# Altium project UZ_A_LTC2311.PrjPCB (part 1 of 2)
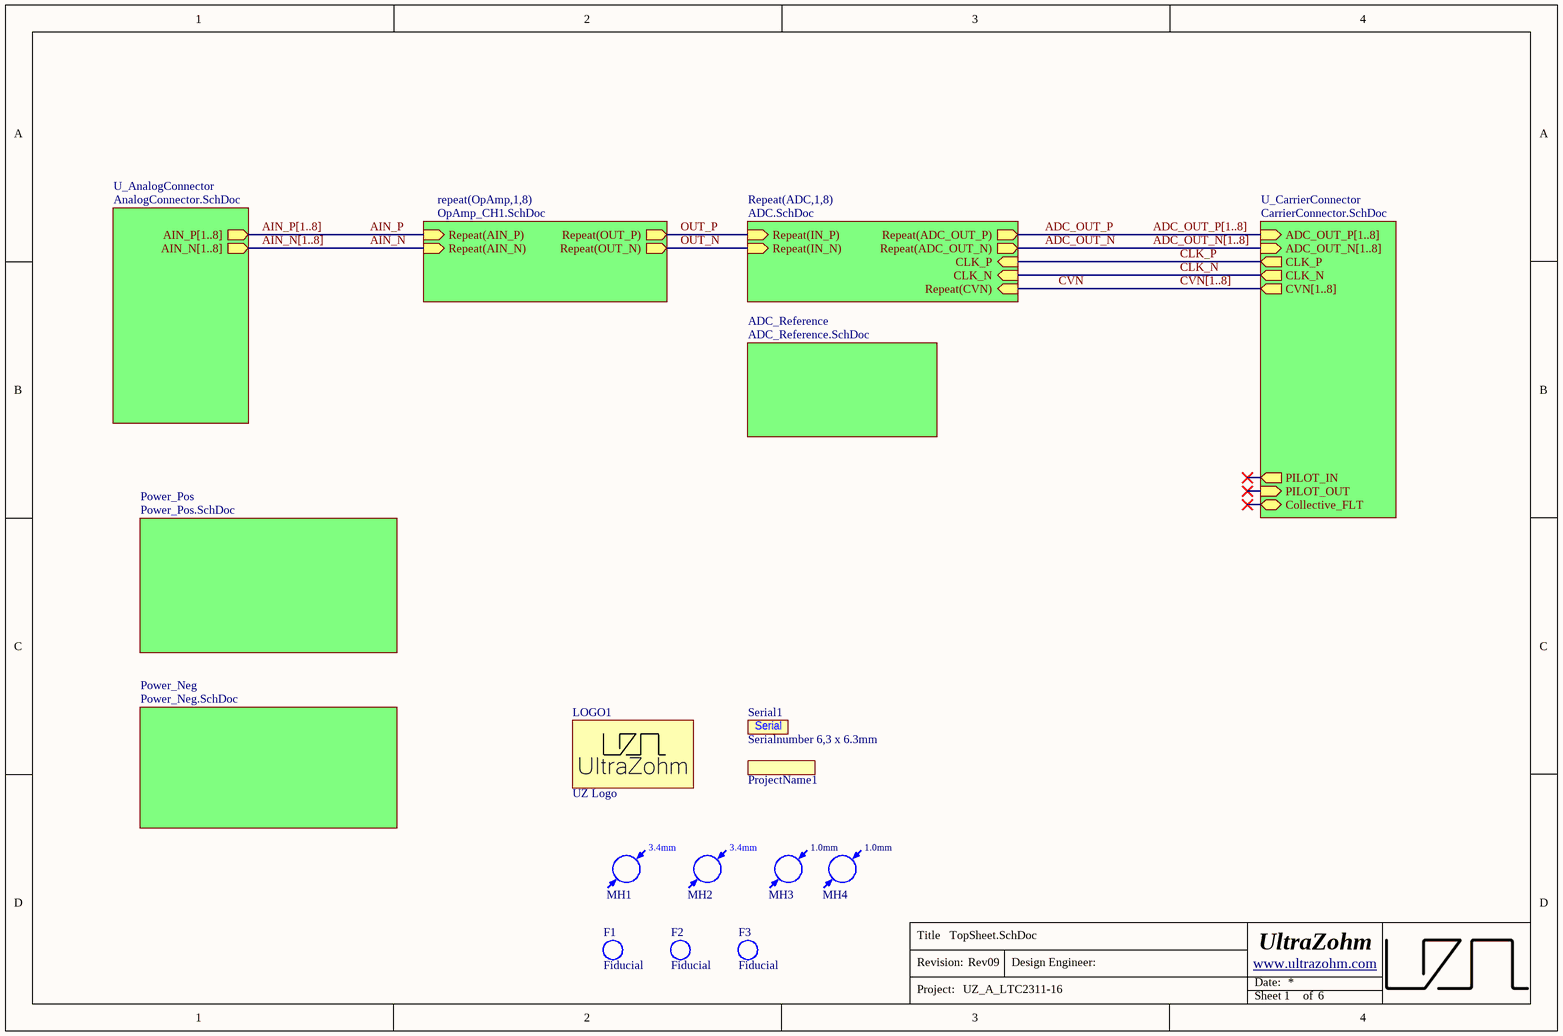
[diagram p0: TopSheet.SchDoc]
ProjectRevision: Rev09; ProjectName: UZ_A_LTC2311-16; ProjectAuthor: =Author; Date: 12/24; AuthorParam: =Author; Author: E. Aufderheide & A. Geiger
8 sheets, 519 parts. Net scope: hierarchical (ports join the sheet entries above them; power ports are global).
Board file: UltraZohm_ADC.PcbDoc
Sheets:
  TopSheet.SchDoc
    Power_Pos = Power_Pos.SchDoc
    U_CarrierConnector = CarrierConnector.SchDoc
    U_AnalogConnector = AnalogConnector.SchDoc
    ADC1 = ADC.SchDoc
    ADC2 = ADC.SchDoc
    ADC3 = ADC.SchDoc
    ADC4 = ADC.SchDoc
    ADC5 = ADC.SchDoc
    ADC6 = ADC.SchDoc
    ADC7 = ADC.SchDoc
    ADC8 = ADC.SchDoc
    OpAmp1 = OpAmp_CH1.SchDoc
    OpAmp2 = OpAmp_CH1.SchDoc
    OpAmp3 = OpAmp_CH1.SchDoc
    OpAmp4 = OpAmp_CH1.SchDoc
    OpAmp5 = OpAmp_CH1.SchDoc
    OpAmp6 = OpAmp_CH1.SchDoc
    OpAmp7 = OpAmp_CH1.SchDoc
    OpAmp8 = OpAmp_CH1.SchDoc
    Power_Neg = Power_Neg.SchDoc
    ADC_Reference = ADC_Reference.SchDoc

## Sheet TopSheet.SchDoc
size A4; CompanyName: Technische Hochschule Nürnberg Georg Simon Ohm; Organization: UltraZohm; Address1: Kesslerplatz 12; Address2: 90489 Nürnberg; Address3: GERMANY; DocumentNumber: 1; SheetNumber: 1; SheetTotal: 6; Website: www.ultrazohm.com

### Parts
F1  Fiducial  [Fiducial_1.7mm]  (no BOM)
F2  Fiducial  [Fiducial_1.7mm]  (no BOM)
F3  Fiducial  [Fiducial_1.7mm]  (no BOM)
LOGO1  UZ Logo  [UZ_Logo_tiny]  (no BOM)
MH1  mounting hole 3,4mm  [MH_3.4]  (value not drawn)  (no BOM)
MH2  mounting hole 3,4mm  [MH_3.4]  (value not drawn)  (no BOM)
MH3  alignment hole 1mm  [MH_1]  (value not drawn)
MH4  alignment hole 1mm  [MH_1]  (value not drawn)
ProjectName1  Project Name, Rev  [ID_ProjectRev]  (value not drawn)  (no BOM)
Serial1  Serialnumber 6,3 x 6.3mm  [Serial_6.3x6.3mm]  (no BOM)

### Sub-sheets
ADC_Reference = ADC_Reference.SchDoc: no entries
Power_Neg = Power_Neg.SchDoc: no entries
Power_Pos = Power_Pos.SchDoc: no entries
Repeat(ADC,1,8) = ADC.SchDoc: Repeat(CVN) (in), Repeat(ADC_OUT_N) (out), Repeat(ADC_OUT_P) (out), Repeat(IN_N) (in), CLK_P (in), CLK_N (in), Repeat(IN_P) (in)
repeat(OpAmp,1,8) = OpAmp_CH1.SchDoc: Repeat(AIN_P) (in), Repeat(AIN_N) (in), Repeat(OUT_P) (out), Repeat(OUT_N) (out)
U_AnalogConnector = AnalogConnector.SchDoc: AIN_P[1..8] (out), AIN_N[1..8] (out)
U_CarrierConnector = CarrierConnector.SchDoc: PILOT_OUT (in), PILOT_IN (out), Collective_FLT (bidir), CLK_P (out), CLK_N (out), ADC_OUT_P[1..8] (in), ADC_OUT_N[1..8] (in), CVN[1..8] (out)

### Nets
ADC_OUT_N: sheet Repeat(ADC,1,8)/Repeat(ADC_OUT_N)
ADC_OUT_P: sheet Repeat(ADC,1,8)/Repeat(ADC_OUT_P)
AIN_N: sheet repeat(OpAmp,1,8)/Repeat(AIN_N)
AIN_P: sheet repeat(OpAmp,1,8)/Repeat(AIN_P)
CLK_N: sheet U_CarrierConnector/CLK_N, sheet Repeat(ADC,1,8)/CLK_N
CLK_P: sheet U_CarrierConnector/CLK_P, sheet Repeat(ADC,1,8)/CLK_P
CVN: sheet Repeat(ADC,1,8)/Repeat(CVN)
OUT_N: sheet Repeat(ADC,1,8)/Repeat(IN_N), sheet repeat(OpAmp,1,8)/Repeat(OUT_N)
OUT_P: sheet Repeat(ADC,1,8)/Repeat(IN_P), sheet repeat(OpAmp,1,8)/Repeat(OUT_P)

### Buses and harness runs
bus ADC_OUT_N[1..8] = sheet U_CarrierConnector/ADC_OUT_N[1..8]
bus ADC_OUT_P[1..8] = sheet U_CarrierConnector/ADC_OUT_P[1..8]
bus AIN_N[1..8] = sheet U_AnalogConnector/AIN_N[1..8]
bus AIN_P[1..8] = sheet U_AnalogConnector/AIN_P[1..8]
bus CVN[1..8] = sheet U_CarrierConnector/CVN[1..8]

### Notes on the sheet
- Title
- Revision:
- Design Engineer:
- Date:
- Project:
- Sheet
- of
- (in symbol Mounting Hole) 3.4mm
- (in symbol Mounting Hole - 1mm) 1.0mm
- (in symbol SerialNumber) Serial

### Library data of the parts
F1-F3 = Fiducial: Fiducial for Assembler
LOGO1 = UZ Logo: UltraZohm Logo on PCB; Created: Jan2021_Liegmann; Value: UZ Logo
MH1 MH2 = Mounting Hole: Non plated through hole, 3.4mm
MH3 MH4 = Mounting Hole - 1mm: Non plated through hole, 1mm
ProjectName1 = ID_ProjectRev: Project Name and Revision Number; Created: 2018_11_23_AGeiger; Value: Project Name, Rev
Serial1 = SerialNumber: Created: 2018_09_18_AGeiger; Value: Serialnumber 6,3 x 6.3mm

## Sheet Power_Pos.SchDoc
size A4; CompanyName: Technische Hochschule Nürnberg Georg Simon Ohm; Organization: UltraZohm; Address1: Kesslerplatz 12; Address2: 90489 Nürnberg; Address3: GERMANY; DocumentNumber: 2; SheetNumber: 2; SheetTotal: 6; Website: www.ultrazohm.com
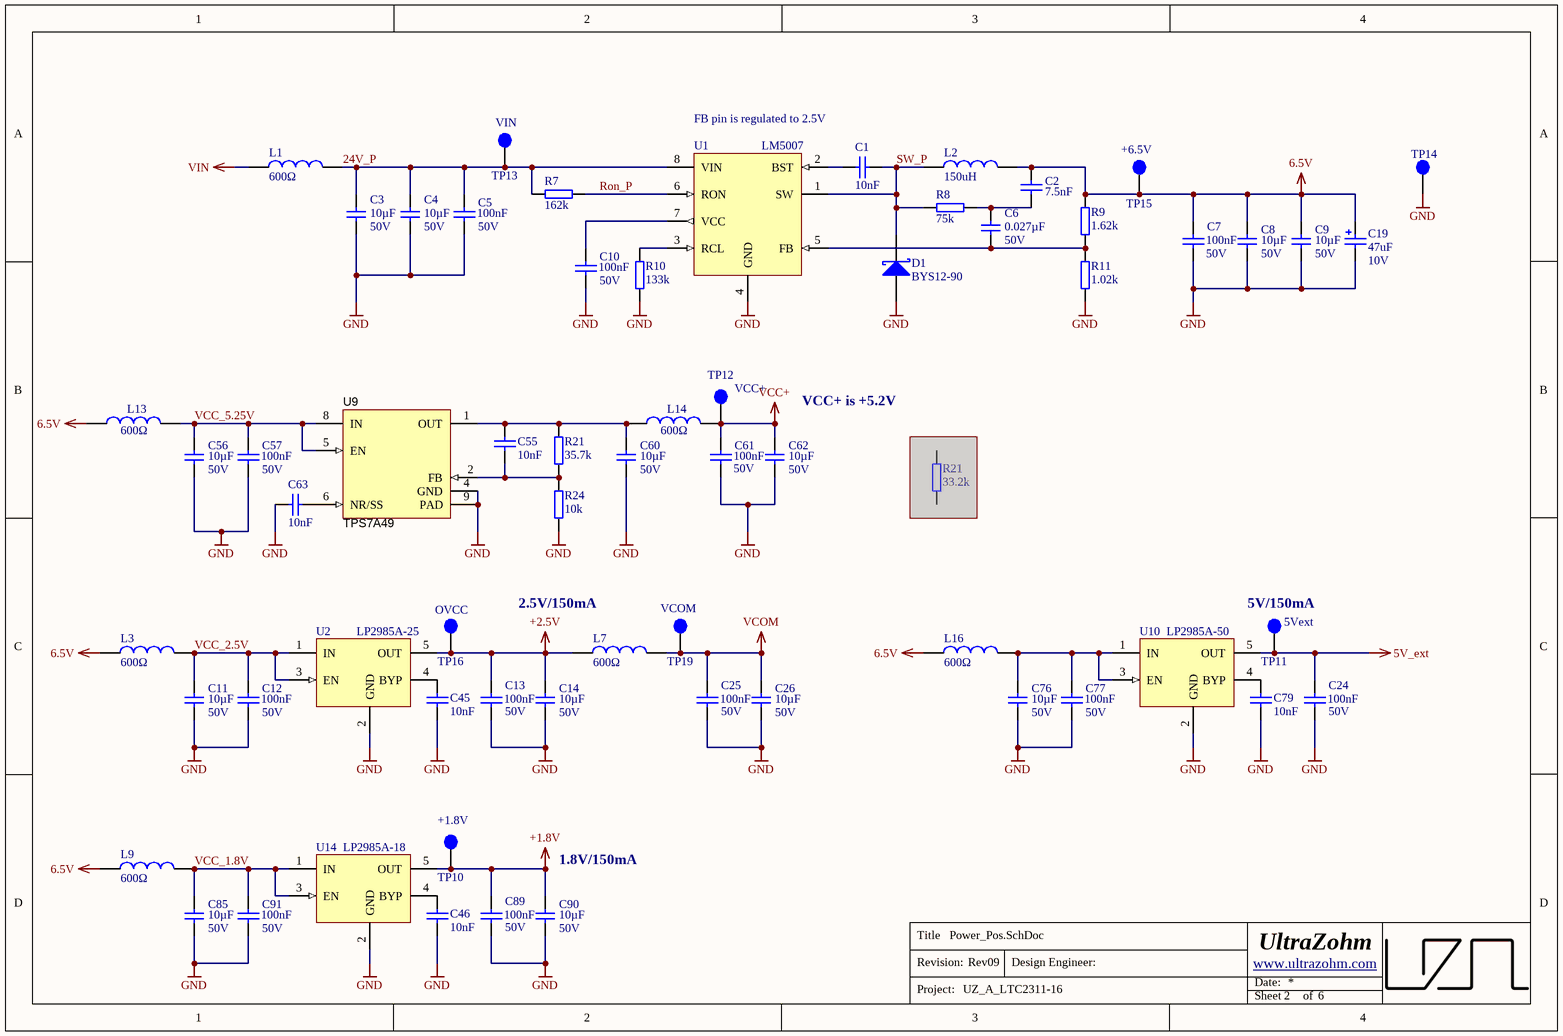
[diagram p1: Power_Pos.SchDoc]

### Parts
(Parts that share a designator on the sheet are numbered #1, #2 ... from top to bottom, then left to right.)
C1  10nF  [CAPC1608X07N]
C2  7.5nF  [CAPC1608X07N]
C3  10µF  Voltage: 50V  [C_1206]
C4  10µF  Voltage: 50V  [C_1206]
C5  100nF  Voltage: 50V  [CAPC1608X07N]
C6  0.027µF  Voltage: 50V  [C_1206]
C7  100nF  Voltage: 50V  [CAPC1608X07N]
C8  10µF  Voltage: 50V  [C_1206]
C9  10µF  Voltage: 50V  [C_1206]
C10  100nF  Voltage: 50V  [CAPC1608X07N]
C11  10µF  Voltage: 50V  [C_1206]
C12  100nF  Voltage: 50V  [CAPC1608X07N]
C13  100nF  Voltage: 50V  [CAPC1608X07N]
C14  10µF  Voltage: 50V  [C_1206]
C19  47uF  Voltage: 10V  [WCAP-ASLI_5x5.5]
C24  100nF  Voltage: 50V  [CAPC1608X07N]
C25  100nF  Voltage: 50V  [CAPC1608X07N]
C26  10µF  Voltage: 50V  [C_1206]
C45  10nF  [CAPC1608X07N]
C46  10nF  [CAPC1608X07N]
C55  10nF  [CAPC1608X07N]
C56  10µF  Voltage: 50V  [C_1206]
C57  100nF  Voltage: 50V  [CAPC1608X07N]
C60  10µF  Voltage: 50V  [C_1206]
C61  100nF  Voltage: 50V  [CAPC1608X07N]
C62  10µF  Voltage: 50V  [C_1206]
C63  10nF  [CAPC1608X07N]
C76  10µF  Voltage: 50V  [C_1206]
C77  100nF  Voltage: 50V  [CAPC1608X07N]
C79  10nF  [CAPC1608X07N]
C85  10µF  Voltage: 50V  [C_1206]
C89  100nF  Voltage: 50V  [CAPC1608X07N]
C90  10µF  Voltage: 50V  [C_1206]
C91  100nF  Voltage: 50V  [CAPC1608X07N]
D1  BYS12-90  [DIOM4227X23N]
L1  600Ω  [WE-CBF_0805_High Current]
L2  150uH  [SMT_inductor_1050_Performance]
L3  600Ω  [WE-CBF_0805_High Current]
L7  600Ω  [WE-CBF_0805_High Current]
L9  600Ω  [WE-CBF_0805_High Current]
L13  600Ω  [WE-CBF_0805_High Current]
L14  600Ω  [WE-CBF_0805_High Current]
L16  600Ω  [WE-CBF_0805_High Current]
R7  162k  [RESC1608X06N]
R8  75k  [RESC1608X06N]
R9  1.62k  [RESC1608X06N]
R10  133k  [RESC1608X06N]
R11  1.02k  [RESC1608X06N]
R21#1  35.7k  [RESC1608X06N]
R21#2  33.2k  [RESC1608X06N]  (masked out: inside a compile mask, not in the netlist)
R24  10k  [RESC1608X06N]
TP10  +1.8V  [TP_1mm]  (no BOM)
TP11  5Vext  [TP_1mm]  (no BOM)
TP12  VCC+  [TP_1mm]  (no BOM)
TP13  VIN  [TP_1mm]  (no BOM)
TP14  GND  [TP_1mm]  (value not drawn)  (no BOM)
TP15  +6.5V  [TP_1mm]  (no BOM)
TP16  OVCC  [TP_1mm]  (no BOM)
TP19  VCOM  [TP_1mm]  (no BOM)
U1  LM5007  [TSOP65P490X110-8N]
U2  LP2985A-25  [SOT95P250X110-5N]
U9  TPS7A49  [DGN0008D_N]
U10  LP2985A-50  [SOT95P250X110-5N]
U14  LP2985A-18  [SOT95P250X110-5N]

### Nets
5V_ext: C24.1 TP11.1 U10.5(OUT)
6.5V: C2.1 C7.2 C8.2 C9.2 C19.2(P) L2.2 L3.1 L9.1 L13.1 L16.1 R9.2 TP15.1
+1.8V: C89.1 C90.2 TP10.1 U14.5(OUT)
+2.5V: C13.1 C14.2 L7.1 TP16.1 U2.5(OUT)
GND: C3.1 C4.1 C5.2 C7.1 C8.1 C9.1 C10.2 C11.1 C12.2 C13.2 C14.1 C19.1(N) C24.2 C25.2 C26.1 C45.1 C46.1 C56.1 C57.2 C60.1 C61.1 C62.1 C63.2 C76.1 C77.2 C79.1 C85.1 C89.2 C90.1 C91.2 D1.2(A) R10.1 R11.1 R24.2 TP14.1 U1.4(GND) U2.2(GND) U9.4(GND) U9.9(PAD) U10.2(GND) U14.2(GND)
VCC+: C61.2 C62.2 L14.2 TP12.1
VCOM: C25.1 C26.2 L7.2 TP19.1
VIN: L1.1
24V_P: C3.2 C4.2 C5.1 L1.2 R7.1 TP13.1 U1.8(VIN)
Ron_P: R7.2 U1.6(RON)
SW_P: C1.2 D1.1(K) L2.1 R8.1 U1.1(SW)
VCC_1.8V: C85.2 C91.1 L9.2 U14.1(IN) U14.3(EN)
VCC_2.5V: C11.2 C12.1 L3.2 U2.1(IN) U2.3(EN)
VCC_5.25V: C56.2 C57.1 L13.2 U9.5(EN) U9.8(IN)
NetC1_1: C1.1 U1.2(BST)
NetC2_2: C2.2 C6.2 R8.2
NetC6_1: C6.1 R9.1 R11.2 U1.5(FB)
NetC10_1: C10.1 U1.7(VCC)
NetC45_2: C45.2 U2.4(BYP)
NetC46_2: C46.2 U14.4(BYP)
NetC55_1: C55.1 C60.2 L14.1 R21#1.1 U9.1(OUT)
NetC55_2: C55.2 R21#1.2 R24.1 U9.2(FB)
NetC63_1: C63.1 U9.6(NR/SS)
NetC76_2: C76.2 C77.1 L16.2 U10.1(IN) U10.3(EN)
NetC79_2: C79.2 U10.4(BYP)
NetR10_2: R10.2 U1.3(RCL)

Not connected (* = marked no-connect by the designer): U9 3(NC) 7(DNC)

### Notes on the sheet
- FB pin is regulated to 2.5V
- VCC+ is +5.2V
- (near L7) 2.5V/150mA
- (near TP11) 5V/150mA
- (near C90) 1.8V/150mA
- Title
- Revision:
- Design Engineer:
- Date:
- Project:
- Sheet
- of

### Library data of the parts
C1 C45 C46 C79 = Cap_0603: MPN: 885012206065; MF: Würth; Voltage: 25V; Dielectric: X7R; Value: 10nF; Supplier 1: Mouser; Supplier 2: *; Supplier Part Number 1: 710-885012206065; Supplier Part Number 2: *; Package: 0603
C2 = Cap_0603: MPN: C0603C752J3GACTU; MF: KEMET; Voltage: 25V; Dielectric: C0G; Value: 7.5nF; Supplier 1: Mouser; Supplier 2: *; Supplier Part Number 1: 80-C0603C752J3GACTU; Supplier Part Number 2: *; Package: 0603
C3 C4 = C_1206: Capacitor 1206; MPN: CL31A106MBHNNNE; Tolerance: 20%; MF: Samsung; Dielectric: X5R; Package: 1206; Value: 10µF; Supplier 1: Mouser; Supplier Part Number 1: 187-CL31A106MBHNNNE
C5 C10 C12 C57 C61 C77 C91 = Cap_0603: MPN: CC0603KRX7R9BB104; MF: Yageo; Tolerance: 10%; Dielectric: X5R; Value: 100nF; Supplier 1: Mouser; Supplier 2: Mouser; Supplier Part Number 1: 603-CC603KRX7R9BB104; Supplier Part Number 2: 710-885382206004; Package: 0603
C6 = C_1206: Capacitor 1206; MPN: GRM3195C1H273JA01D; Tolerance: 5%; MF: Murata; Dielectric: C0G; Package: 1206; Value: 0.027µF; Created: 2018_06_25_AGeiger; Supplier 1: Mouser; Supplier Part Number 1: 81-GRM315C1H273JA01D
C7 C13 C24 C25 C89 = Cap_0603: MPN: CC0603KRX7R9BB104; MF: Yageo; Dielectric: X5R; Value: 100nF; Supplier 1: Mouser; Supplier 2: Mouser; Supplier Part Number 1: 603-CC603KRX7R9BB104; Supplier Part Number 2: 710-885382206004; Package: 0603
C8 C9 C11 C14 C26 C56 C60 C62 C76 C85 C90 = C_1206: Capacitor 1206; MPN: CL31A106MBHNNNE; Tolerance: 10%; MF: Samsung; Dielectric: X5R; Package: 1206; Value: 10µF; Created: 2020_09_17_Liegmann; Supplier 1: Mouser; Supplier Part Number 1: 187-CL31A106MBHNNNE
C19 = 865080142007: WCAP-ASLI Aluminum Electrolytic Capacitor, V-Chip, SMT, D5xH5.5mm, 47uF, 10V; MPN: 865080242004; Dissipation Factor: 24%; Endurance: 2000h; Leakage Current: 6.3uA; MF: Wurth Elektronik; Ripple Current: 170mA; Capacitance Tolerance: +/-20%; Technical Reference: ASEC055101M6R3DVCTBB000; ComponentLink1Description: Manufacturer; ComponentLink1URL: http://www.we-online.de; ComponentLink2Description: Datasheet; ComponentLink2URL: https://www.we-online.com/catalog/datasheet/865080142007.pdf; Height: 5.5mm; Mounting Technology: SMT; Operating Temperature: -55 to +105degC; Packaging: Tape and Reel; Published Date: May 2020; Diameter: 5mm; Supplier 1: Mouser; Supplier Part Number 1: 710-865080242004; Value: 47uF
C55 C63 = Cap_0603: MPN: 885012206065; MF: Würth Elektronik; Voltage: 25V; Dielectric: X7R; Value: 10nF; Supplier 1: Mouser; Supplier 2: Digi-Key; Supplier Part Number 1: 710-885012206065; Supplier Part Number 2: 732-7983-1-ND; Package: 0603
D1 = BYS12-90: Schottky Diode; MPN: BYS12-90-E3/TR3; MF: Vishay; Forward Voltage: 750mV; Reverse Voltage: 90V; Rated Current: 1.5A; Package: DO-214AC; Supplier 1: Farnell; Supplier 2: Mouser; Supplier 3: Digi-Key; Supplier Part Number 1: 2889144; Supplier Part Number 2: 625-BYS12-90-E3/TR3; Supplier Part Number 3: BYS12-90-E3/GICT-ND; ComponentLink1Description: Manufacturer; ComponentLink1URL: https://www.vishay.com/; ComponentLink2Description: Datasheet; ComponentLink2URL: https://www.vishay.com/docs/88950/bys12-90.pdf
L1 L3 L7 L9 L16 = WE-CBF, 742792040: WE-CBF SMD EMI Suppression Ferrite Bead, 0805, 600Ω; MF: Wurth Elektronik; Type: High Current; PublishedDate: Aug 2016; ComponentLink1Description: Manufacturer; ComponentLink1URL: http://www.we-online.de; ComponentLink2Description: Datasheet; ComponentLink2URL: http://katalog.we-online.de/pbs/datasheet/742792040.pdf; MPN: 742792040; Value: 600Ω; Size: 0805; Supplier 1: Farnell; Supplier 2: Mouser; Supplier 3: Digi-Key; Supplier Part Number 1: 2761567; Supplier Part Number 2: 710-742792040; Supplier Part Number 3: 732-1620-1-ND
L2 = B82464G4154M: SMT power Inductor, 150uH, 320m DRC; MF: EPCOS / TDK; Rated Current: 0.85 A; MPN: B82464G4154M; Supplier 1: Mouser; Supplier Part Number 1: 871-B82464G4154M; Value: 150uH; DCR: 320m; ComponentLink1Description: Manufacturer; ComponentLink1URL: https://www.tdk-electronics.tdk.com/de; ComponentLink2Description: Datasheet; ComponentLink2URL: https://www.tdk-electronics.tdk.com/inf/30/db/ind_2008/b82464g4.pdf
L13 L14 = WE-CBF, 742792040: WE-CBF SMD EMI Suppression Ferrite Bead, 0805, 600Ω; MF: Würth Elektronik; Type: High Current; ComponentLink1Description: Manufacturer; ComponentLink1URL: http://www.we-online.de; ComponentLink2Description: Datasheet; ComponentLink2URL: http://katalog.we-online.de/pbs/datasheet/742792040.pdf; MPN: 742792040; Value: 600Ω; Size: 0805; Supplier 1: Farnell; Supplier 2: Mouser; Supplier 3: Digi-Key; Supplier Part Number 1: 1635735; Supplier Part Number 2: 710-742792040; Supplier Part Number 3: 732-1620-1-ND
R7 = R_0603: MPN: CR0603-FX-1623ELF; MF: Bourns; Value: 162k; Supplier 1: Mouser; Supplier Part Number 1: 652-CR0603-FX1623ELF; Package: 0603
R8 = R_0603: MPN: AC0603FR-1375KL; MF: Yageo; Value: 75k; Supplier 1: Mouser; Supplier Part Number 1: 603-AC0603FR-1375KL; Package: 0603
R9 = R_0603: MPN: CR0603-FX-1621ELF; MF: Bourns; Tolerance: 1%; Value: 1.62k; Supplier 1: Mouser; Supplier Part Number 1: 652-CR0603FX-1621ELF; Package: 0603
R10 = R_0603: MPN: CR0603-FX-1333ELF; MF: Bourns; Value: 133k; Supplier 1: Mouser; Supplier Part Number 1: 652-CR0603FX-1333ELF; Package: 0603
R11 = R_0603: MPN: CR0603-FX-1021ELF; MF: Bourns; Tolerance: 1%; Value: 1.02k; Supplier 1: Mouser; Supplier Part Number 1: 652-CR0603FX-1021ELF; Package: 0603
R21#1 = R_0603: MPN: CR0603-FX-3572ELF; MF: Bourns; Tolerance: 1%; Value: 35.7k; Supplier 1: Mouser; Supplier Part Number 1: 652-CR0603FX-3572ELF; Package: 0603
R21#2 = R_0603: MPN: CR0603-FX-3322ELF; MF: Bourns; Tolerance: 1%; Value: 33.2k; Supplier 1: Mouser; Supplier Part Number 1: 652-CR0603FX-3322ELF; Package: 0603
R24 = R_0603: MPN: CR0603-FX-1002ELF; MF: Bourns; Tolerance: 1%; Value: 10k; Supplier 1: Mouser; Supplier Part Number 1: 652-CR0603FX-1002ELF; Package: 0603
TP10-TP16 TP19 = TP_1mm: Testpoint 1mm; Created: 2018_06_25_AGeiger; Value: Testpoint 1mm
U1 = LM5007: Buck Converter, 9-75Vin, 2.5-73Vout; MPN: LM5007MM/NOPB; MF: Texas Instruments; Supplier 1: Farnell; Supplier 2: Mouser; Supplier 3: Digi-Key; Supplier Part Number 1: 9779345; Supplier Part Number 2: 926-LM5007MM/NOPB; Supplier Part Number 3: LM5007MM/NOPBCT-ND; Package: VSSOP-8; ComponentLink1Description: Manufacturer; ComponentLink1URL: https://www.ti.com/; ComponentLink2Description: Datasheet; ComponentLink2URL: https://www.ti.com/lit/ds/symlink/lm5007.pdf?ts=1616234834930&ref_url=https%253A%252F%252Fwww.google.ru%252F
U2 = LP2985A-25: 150mA, LDO, Vout = 2.5V, Vin,max = 16V; MF: Texas Instruments; MPN: LP2985A-25; Supplier 1: Mouser; Supplier Part Number 1: 595-LP2985A-25DBVR; Package: SOT-23-5; ComponentLink1Description: Manufacturer; ComponentLink1URL: https://www.ti.com/; ComponentLink2Description: Datasheet; ComponentLink2URL: https://www.ti.com/lit/ds/symlink/lp2985a.pdf
U9 = TPS7A4901DGN: +36V, +150mA, Ultralow-Noise, Positive LINEAR REGULATOR, DGN0008D; CompType: IC; MF: Texas Instruments; MPN: TPS7A4901DGN; PackageReference: DGN0008D; MountType: SMT; ComponentLink1Description: Datasheet Link; ComponentLink1URL: http://www.ti.com/lit/ds/symlink/tps7a4901.pdf; Supplier 1: Digi-Key; Supplier Part Number 1: 296-27751-6-ND; Supplier 2: Mouser; Supplier Part Number 2: 595-TPS7A4901DGNR; Supplier 3: Fanell; Supplier Part Number 3: 3008004
U10 = LP2985A-50: 150mA, LDO, Vout = 5V, Vin,max = 16V; MF: Texas Instruments; Supplier 1: Mouser; Supplier Part Number 1: 595-LP2985A-50DBVR; Package: SOT-23-5; ComponentLink1Description: Manufacturer; ComponentLink1URL: https://www.ti.com/; ComponentLink2Description: Datasheet; ComponentLink2URL: https://www.ti.com/lit/ds/symlink/lp2985a.pdf; MPN: LP2985A-50
U14 = LP2985A-18: 150mA, LDO, Vout = 1.8V , Vin,max = 16V; MF: Texas Instruments; Supplier 1: Mouser; Supplier Part Number 1: 595-LP2985A-18DBVJ; Package: SOT-23-5; ComponentLink1Description: Manufacturer; ComponentLink1URL: https://www.ti.com/; ComponentLink2Description: Datasheet; ComponentLink2URL: https://www.ti.com/lit/ds/symlink/lp2985a.pdf; MPN: LP2985A-18

## Sheet CarrierConnector.SchDoc
size A4; CompanyName: Technische Hochschule Nürnberg Georg Simon Ohm; Organization: UltraZohm; Address1: Kesslerplatz 12; Address2: 90489 Nürnberg; Address3: GERMANY; DocumentNumber: 3; SheetNumber: 3; SheetTotal: 6; Website: www.ultrazohm.com
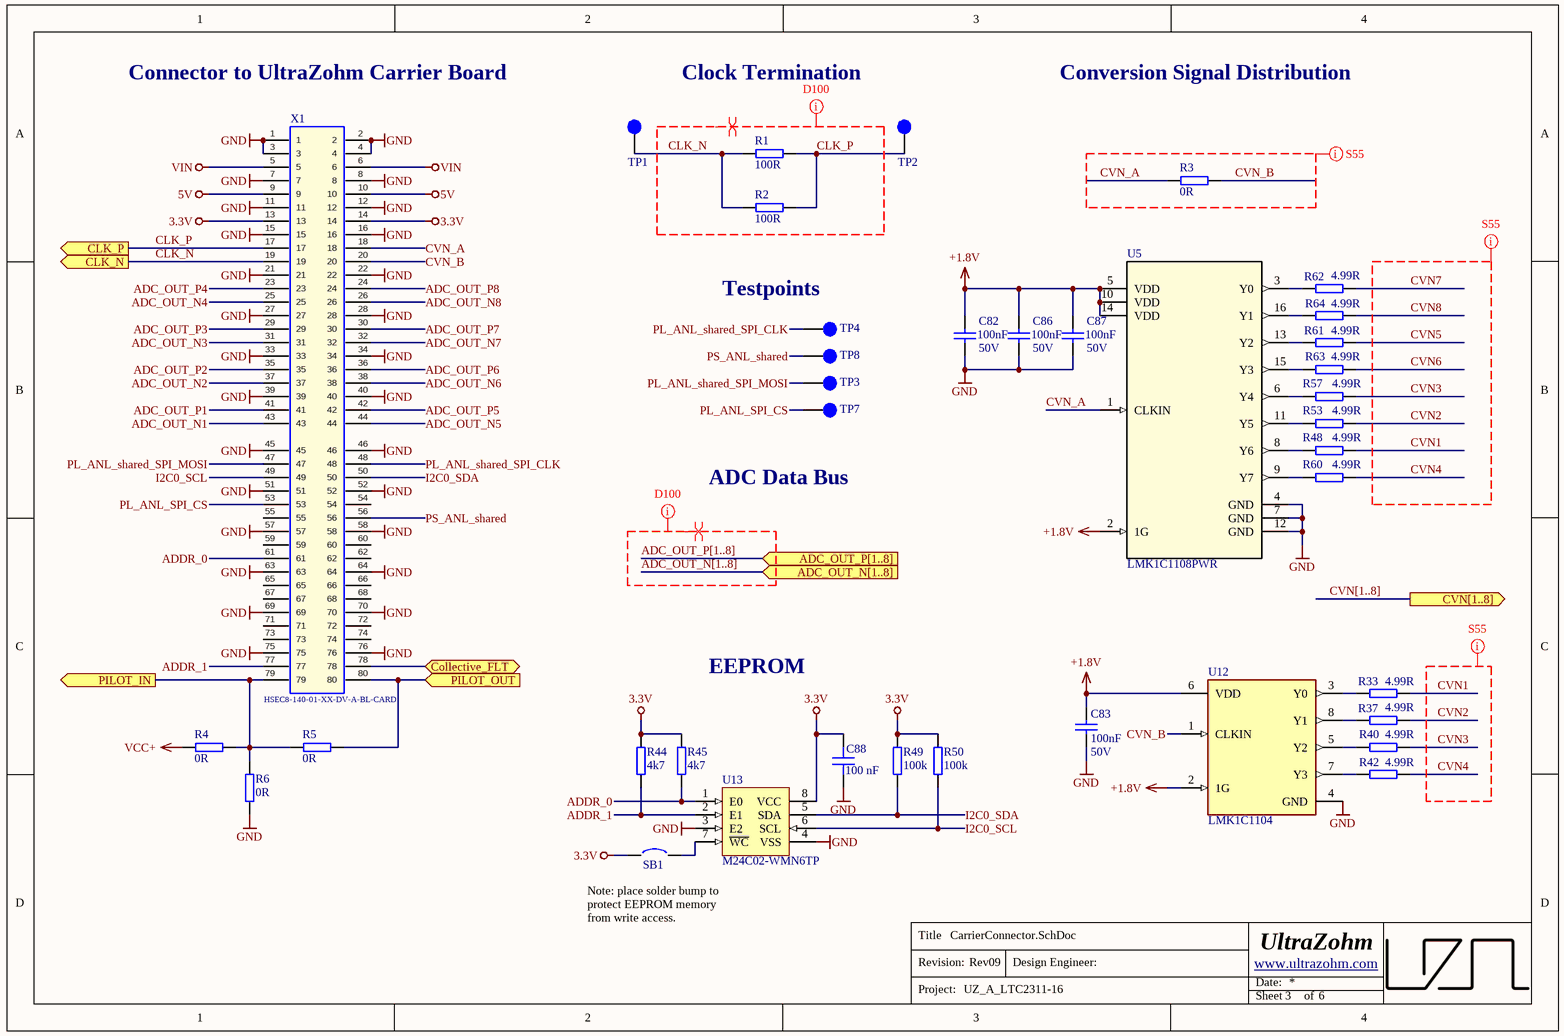
[diagram p2: CarrierConnector.SchDoc]

### Parts
C82  100nF  Voltage: 50V  [CAPC1608X07N]
C83  100nF  Voltage: 50V  [CAPC1608X07N]
C86  100nF  Voltage: 50V  [CAPC1608X07N]
C87  100nF  Voltage: 50V  [CAPC1608X07N]
C88  100 nF  [C_0603]
R1  100R  [RESC1608X06N]
R2  100R  [RESC1608X06N]
R3  0R  [RESC1608X06N]
R4  0R  [RESC1608X06N]
R5  0R  [RESC1608X06N]
R6  0R  [RESC1608X06N]
R33  4.99R  [RESC1608X06N]
R37  4.99R  [RESC1608X06N]
R40  4.99R  [RESC1608X06N]
R42  4.99R  [RESC1608X06N]
R44  4k7  [RES 0603_1608]
R45  4k7  [RES 0603_1608]
R48  4.99R  [RESC1608X06N]
R49  100k  [RES 0603_1608]
R50  100k  [RES 0603_1608]
R53  4.99R  [RESC1608X06N]
R57  4.99R  [RESC1608X06N]
R60  4.99R  [RESC1608X06N]
R61  4.99R  [RESC1608X06N]
R62  4.99R  [RESC1608X06N]
R63  4.99R  [RESC1608X06N]
R64  4.99R  [RESC1608X06N]
SB1  Solder Bump 0603  [SB_0603]  (value not drawn)  (no BOM)
TP1  ACLK_N  [TP_1mm]  (value not drawn)  (no BOM)
TP2  ACLK_P  [TP_1mm]  (value not drawn)  (no BOM)
TP3  PIN47  [TP_1mm]  (value not drawn)  (no BOM)
TP4  PIN48  [TP_1mm]  (value not drawn)  (no BOM)
TP7  PIN53  [TP_1mm]  (value not drawn)  (no BOM)
TP8  PIN56  [TP_1mm]  (value not drawn)  (no BOM)
U5  LMK1C1108PWR  [PW0016A_M]
U12  LMK1C1104  [FP-PW0008A-MFG]
U13  M24C02-WMN6TP  [D0008A_N]
X1  HSEC8-140-01-XX-DV-A-BL-CARD  [HSEC8-140-01-XX-DV-A-BL-CARD]  (no BOM)

### Ports
ADC_OUT_N[1..8] (in), ADC_OUT_P[1..8] (in), CLK_N (out), CLK_P (out), Collective_FLT (bidir), CVN[1..8] (out), PILOT_IN (out), PILOT_OUT (in)

### Nets
3.3V: C88.1 R44.2 R45.2 R49.2 R50.2 SB1.1 U13.8(VCC) X1.13 X1.14
5V: X1.9 X1.10
+1.8V: C82.1 C83.1 C86.1 C87.1 U5.2(1G) U5.5(VDD) U5.10(VDD) U5.14(VDD) U12.2(1G) U12.6(VDD)
GND: C82.2 C83.2 C86.2 C87.2 C88.2 R6.1 U5.4(GND) U5.7(GND) U5.12(GND) U12.4(GND) U13.3(E2) U13.4(VSS) X1.1 X1.2 X1.3 X1.4 X1.7 X1.8 X1.11 X1.12 X1.15 X1.16 X1.21 X1.22 X1.27 X1.28 X1.33 X1.34 X1.39 X1.40 X1.45 X1.46 X1.51 X1.52 X1.57 X1.58 X1.63 X1.64 X1.69 X1.70 X1.75 X1.76
VCC+: R4.1
VIN: X1.5 X1.6
ADC_OUT_N1: X1.43
ADC_OUT_N2: X1.37
ADC_OUT_N3: X1.31
ADC_OUT_N4: X1.25
ADC_OUT_N5: X1.44
ADC_OUT_N6: X1.38
ADC_OUT_N7: X1.32
ADC_OUT_N8: X1.26
ADC_OUT_P1: X1.41
ADC_OUT_P2: X1.35
ADC_OUT_P3: X1.29
ADC_OUT_P4: X1.23
ADC_OUT_P5: X1.42
ADC_OUT_P6: X1.36
ADC_OUT_P7: X1.30
ADC_OUT_P8: X1.24
ADDR_0: R45.1 U13.1(E0) X1.61
ADDR_1: R44.1 U13.2(E1) X1.77
CLK_N: R1.1 R2.1 TP1.1 X1.19 ; port CLK_N
CLK_P: R1.2 R2.2 TP2.1 X1.17 ; port CLK_P
CVN1: R33.2 R48.2
CVN2: R37.2 R53.2
CVN3: R40.2 R57.2
CVN4: R42.2 R60.2
CVN5: R61.2
CVN6: R63.2
CVN7: R62.2
CVN8: R64.2
CVN_A: R3.1 U5.1(CLKIN) X1.18
CVN_B: R3.2 U12.1(CLKIN) X1.20
I2C0_SCL: R50.1 U13.6(SCL) X1.49
I2C0_SDA: R49.1 U13.5(SDA) X1.50
PL_ANL_shared_SPI_CLK: TP4.1 X1.48
PL_ANL_shared_SPI_MOSI: TP3.1 X1.47
PL_ANL_SPI_CS: TP7.1 X1.53
PS_ANL_shared: TP8.1 X1.56
NetR4_2: R4.2 R5.1 R6.2 X1.79 ; port PILOT_IN
NetR5_2: R5.2 X1.80 ; port PILOT_OUT
NetR33_1: R33.1 U12.3(Y0)
NetR37_1: R37.1 U12.8(Y1)
NetR40_1: R40.1 U12.5(Y2)
NetR42_1: R42.1 U12.7(Y3)
NetR48_1: R48.1 U5.8(Y6)
NetR53_1: R53.1 U5.11(Y5)
NetR57_1: R57.1 U5.6(Y4)
NetR60_1: R60.1 U5.9(Y7)
NetR61_1: R61.1 U5.13(Y2)
NetR62_1: R62.1 U5.3(Y0)
NetR63_1: R63.1 U5.15(Y3)
NetR64_1: R64.1 U5.16(Y1)
NetSB1_2: SB1.2 U13.7(~{WC})
NetX1_78: X1.78 ; port Collective_FLT

Not connected (* = marked no-connect by the designer): X1 54 55 59 60 62 65 66 67 68 71 72 73 74

### Buses and harness runs
bus ADC_OUT_N[1..8] = port ADC_OUT_N[1..8]
bus ADC_OUT_P[1..8] = port ADC_OUT_P[1..8]
bus CVN[1..8] = port CVN[1..8]

### Layout directives
differential pair: ADC_OUT_N[1..8], ADC_OUT_P[1..8], CLK_N, CLK_P
net class D100: ADC_OUT_N[1..8], ADC_OUT_P[1..8], CLK_N, CLK_P
net class S55: CVN1, CVN2, CVN3, CVN4, CVN5, CVN6, CVN7, CVN8, CVN_A, CVN_B

### Notes on the sheet
- Connector to UltraZohm Carrier Board
- Clock Termination
- Conversion Signal Distribution
- (near TP4) Testpoints
- ADC Data Bus
- EEPROM
- Note: place solder bump to protect EEPROM memory from write access.
- Title
- Revision:
- Design Engineer:
- Date:
- Project:
- Sheet
- of

### Library data of the parts
C82 C83 C86 C87 = Cap_0603: as C7 on sheet Power_Pos; Value: 100nF; Supplier 1: Mouser; Supplier 2: Mouser; Supplier Part Number 1: 603-CC603KRX7R9BB104; Supplier Part Number 2: 710-885382206004; Package: 0603
C88 = C0603C104K9PACTU: Capacitor 0603, 6.3 VDC, 100 nF, X5R; Manufacturer: KEMET; Tolerance: 10 %; Voltage Rating: 6.3 VDC; Created from: MGremer; Manufacturer Part Number: C0603C104K9PACTU; PartID: 70; Created On: 20.12.2020 13:54:13; ComponentLink1Description: Datasheet; ComponentLink1URL: https://www.mouser.de/datasheet/2/212/KEM_C1006_X5R_SMD-1103249.pdf; Component Type: Capacitor 0603; Device Package: 0603; Last Updated: 20.01.2021 13:57:36; Mounting Type: SMD; Operating Temperature: -55 - 85°C; Series: SMD Comm X5R; Supplier 1: Mouser; Supplier Part Number 1: 80-C0603C104K9P; Type: Capacitor; Value: 100 nF; Live Cycle Status: 1; Stock number: not stored; MF: KEMET; MPN: C0603C104K9PACTU; Package: 0603
R1 R2 = R_0603: MPN: AC0603FR-13100RL; MF: Yageo; Tolerance: 1%; Value: 100R; Supplier 1: Mouser; Supplier Part Number 1: 603-AC0603FR-13100RL; Package: 0603
R3-R6 = R_0603: MPN: CRCW06030000Z0EBC; MF: Vishay / Dale; Value: 0R; Supplier 1: Mouser; Supplier Part Number 1: 71-CRCW06030000Z0EBC; Package: 0603
R33 R37 R40 R42 R48 R53 R57 R60-R64 = R_0603: MPN: CRCW06034R99FKEA; MF: Vishay / Dale; Tolerance: 1%; Value: 4.99R; Supplier 1: Mouser; Supplier Part Number 1: 71-CRCW0603-4.99-E3; Package: *
R44 R45 = 0603WAF4701T5E: SMD resistor E24 series; Manufacturer: UNI-ROYAL; Tolerance: 1%; Created from: AGeiger; Manufacturer Part Number: 0603WAF4701T5E; PartID: 90; Created On: 14.12.2020 16:17:14; ComponentLink1Description: Datasheet; ComponentLink1URL: https://datasheet.lcsc.com/lcsc/2206010116_UNI-ROYAL-Uniroyal-Elec-0603WAF4701T5E_C23162.pdf; Component Type: SMD resistor; Device Package: 0603; Last Updated: 25.08.2022 20:03:04; Mounting Type: SMD; Supplier 1: LCSC; Supplier Part Number 1: C23162; Type: Resistor; Value: 4k7; Live Cycle Status: 1; Stock number: Labor SMD Container; LCSC Part Number: C23162; Package: 0603
R49 R50 = RK73B1JTTD104J: SMD resistor E24 series; Manufacturer: KOA Speer; Tolerance: 5%; Created from: MGremer; Manufacturer Part Number: RK73B1JTTD104J; PartID: 122; Created On: 14.12.2020 16:17:14; ComponentLink1Description: Datasheet; ComponentLink1URL: https://www.mouser.de/datasheet/2/219/RK73B-1825463.pdf; Component Type: SMD resistor; Device Package: 0603; Last Updated: 27.05.2022 14:04:10; Mounting Type: SMD; Supplier 1: Mouser; Supplier Part Number 1: 660-RK73B1JTTD104J; Type: Resistor; Value: 100k; Live Cycle Status: 1; Stock number: Labor SMD Container; LCSC Part Number: C25803
SB1 = =Value: Created from: AGeiger; Revision: July-2002: Re-released for DXP Platform.; PartID: 1; Created On: 09.01.2024 17:13:56; Component Type: Solder Bump; Device Package: 0603; Last Updated: 09.01.2024 17:13:56; Manufacturer Part Number: Solder Bump 0603; Mounting Type: SMD; Value: Solder Bump 0603
TP1-TP4 TP7 TP8 = TP_1mm: Testpoint 1mm; Created: 2018_06_25_AGeiger; Value: Testpoint 1mm
U5 = LMK1C1108PWR: 8-channel output LVCMOS 1.8V buffer; MF: Texas Instruments; MPN: LMK1C1108PWR; Supplier 1: Digi-Key; Supplier 2: Mouser; Supplier Part Number 1: 296-LMK1C1108PWRCT-ND; Supplier Part Number 2: 595-LMK1C1108PWR
U12 = LMK1C1104: 4-channel output LVCMOS 1.8-V buffer; Manufacturer: Texas Instruments; Manufacturer Part Number: LMK1C1104PWR; Number of Outputs: 4; Frequency: 250MHz; Max Supply Voltage: 3.465V; Min Supply Voltage: 1.71V; Propagation Delay: 3ns; Mount: Surface Mount; Package: TSSOP; Number of Pins: 8; Input: LVCMOS; Supplier 1: Mouser; Supplier Part Number 1: 595-LMK1C1104PWR; ComponentLink1Description: Manufacturer; ComponentLink1URL: https://www.ti.com/; ComponentLink2Description: Datasheet; ComponentLink2URL: https://www.ti.com/lit/ds/symlink/lmk1c1104.pdf?ts=1616933763692&ref_url=https%253A%252F%252Fwww.ti.com%252Fproduct%252FLMK1C1104; Supplier 2: Mouser; Supplier Part Number 2: 972-5PB1104PGGK8; MF: Texas Instruments; MPN: LMK1C1104PWR
U13 = M24C02-WMN6TP: 2Kbit I2C SOP-8 EEPROM ROHS; Manufacturer: STMicroelectronics; Created from: AGeiger; Manufacturer Part Number: M24C02-WMN6TP; PartID: 1; Created On: 19.11.2023 14:54:27; ComponentLink1Description: Datasheet; ComponentLink1URL: https://www.st.com/resource/en/datasheet/m24c01-w.pdf; Component Type: EEPROM; Device Package: SOIC-8; Last Updated: 19.11.2023 21:39:04; Mounting Type: SMD; Operating Temperature: -40 to +85 °C; Series: M24xxx; Supplier 1: Mouser; Supplier Part Number 1: 511-M24C02-WMN6TP; Supplier 2: LCSC; Supplier Part Number 2: C7562; Type: Memory; Value: M24C02-WMN6TP; LCSC Part Number: C7562; MF: STMicroelectronics; MPN: M24C02-WMN6TP
X1 = HSEC8-140-01-XX-DV-A-BL-CARD: Mating Card Layout for HSEC8-140-01-XX-DV-A-BL; Manufacturer: SAMTEC; Created: 2018_04_23_AGeiger; Value: HSEC8-140-01-XX-DV-A-BL-CARD; ComponentLink1Description: Info; ComponentLink1URL: https://www.samtec.com/de/products/hsec8-140-01-l-dv-a-bl-k-tr; MF: SAMTEC

## Sheet AnalogConnector.SchDoc
size A4; CompanyName: Technische Hochschule Nürnberg Georg Simon Ohm; Organization: UltraZohm; Address1: Kesslerplatz 12; Address2: 90489 Nürnberg; Address3: GERMANY; DocumentNumber: 4; SheetNumber: 4; SheetTotal: 6; Website: www.ultrazohm.com
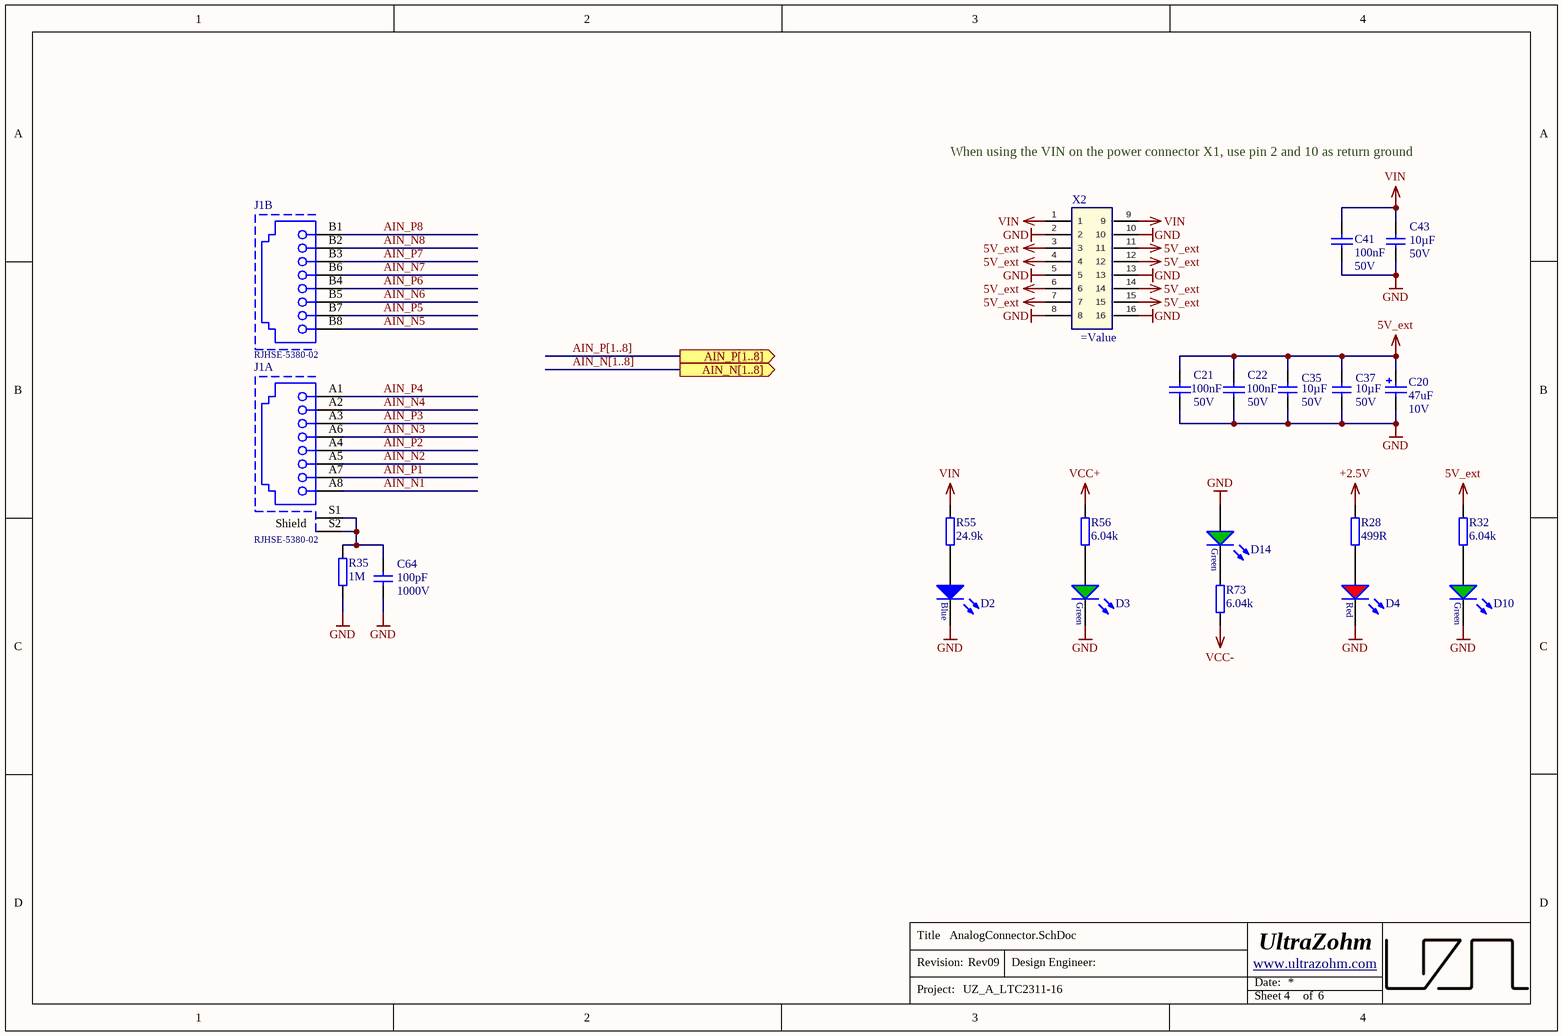
[diagram p3: AnalogConnector.SchDoc]

### Parts
C20  47uF  Voltage: 10V  [WCAP-ASLI_5x5.5]
C21  100nF  Voltage: 50V  [CAPC1608X07N]
C22  100nF  Voltage: 50V  [CAPC1608X07N]
C35  10µF  Voltage: 50V  [C_1206]
C37  10µF  Voltage: 50V  [C_1206]
C41  100nF  Voltage: 50V  [CAPC1608X07N]
C43  10µF  Voltage: 50V  [C_1206]
C64  100pF  Voltage: 1000V  [C_1206]
D2  150060BS75000  [WL-SMCW_0603]  (value not drawn)
D3  150060GS75000  [WL-SMCW_0603]  (value not drawn)
D4  150060RS75000  [WL-SMCW_0603]  (value not drawn)
D10  150060GS75000  [WL-SMCW_0603]  (value not drawn)
D14  150060GS75000  [WL-SMCW_0603]  (value not drawn)
J1  RJHSE-5380-02  [RJHSE-5380-02]  (parts A,B of 2)
R28  499R  [RESC1608X06N]
R32  6.04k  [RESC1608X06N]
R35  1M  [RESC1608X06N]
R55  24.9k  [RESC1608X06N]
R56  6.04k  [RESC1608X06N]
R73  6.04k  [RESC1608X06N]
X2  (no value)  [IPL1-108-01-L-D-RA-K]

### Ports
AIN_N[1..8] (out), AIN_P[1..8] (out)

### Nets
5V_ext: C20.2(P) C21.2 C22.2 C35.2 C37.2 R32.2 X2.3 X2.4 X2.6 X2.7 X2.11 X2.12 X2.14 X2.15
+2.5V: R28.2
GND: C20.1(N) C21.1 C22.1 C35.1 C37.1 C41.1 C43.1 C64.1 D2.1(K) D3.1(K) D4.1(K) D10.1(K) D14.2(A) R35.1 X2.2 X2.5 X2.8 X2.10 X2.13 X2.16
VCC+: R56.2
VCC-: R73.1
VIN: C41.2 C43.2 R55.2 X2.1 X2.9
AIN_N1: J1.A8
AIN_N2: J1.A5
AIN_N3: J1.A6
AIN_N4: J1.A2
AIN_N5: J1.B8
AIN_N6: J1.B5
AIN_N7: J1.B6
AIN_N8: J1.B2
AIN_P1: J1.A7
AIN_P2: J1.A4
AIN_P3: J1.A3
AIN_P4: J1.A1
AIN_P5: J1.B7
AIN_P6: J1.B4
AIN_P7: J1.B3
AIN_P8: J1.B1
NetC64_2: C64.2 J1.S1 J1.S2 R35.2
NetD2_2: D2.2(A) R55.1
NetD3_2: D3.2(A) R56.1
NetD4_2: D4.2(A) R28.1
NetD10_2: D10.2(A) R32.1
NetD14_1: D14.1(K) R73.2

### Buses and harness runs
bus AIN_N[1..8] = port AIN_N[1..8]
bus AIN_P[1..8] = port AIN_P[1..8]

### Notes on the sheet
- When using the VIN on the power connector X1, use pin 2 and 10 as return ground
- (near J1) Shield
- Title
- Revision:
- Design Engineer:
- Date:
- Project:
- Sheet
- of

### Library data of the parts
C20 = 865080142007: as C19 on sheet Power_Pos; ComponentLink1Description: Manufacturer; ComponentLink1URL: http://www.we-online.de; ComponentLink2Description: Datasheet; ComponentLink2URL: https://www.we-online.com/catalog/datasheet/865080142007.pdf; Height: 5.5mm; Mounting Technology: SMT; Operating Temperature: -55 to +105degC; Packaging: Tape and Reel; Published Date: May 2020; Diameter: 5mm; Supplier 1: Mouser; Supplier Part Number 1: 710-865080242004; Value: 47uF
C21 C22 = Cap_0603: as C7 on sheet Power_Pos; Value: 100nF; Supplier 1: Mouser; Supplier 2: Mouser; Supplier Part Number 1: 603-CC603KRX7R9BB104; Supplier Part Number 2: 710-885382206004; Package: 0603
C35 C37 = C_1206: as C8 on sheet Power_Pos; Package: 1206; Value: 10µF; Created: 2020_09_17_Liegmann; Supplier 1: Mouser; Supplier Part Number 1: 187-CL31A106MBHNNNE
C41 = Cap_0603: as C5 on sheet Power_Pos; Value: 100nF; Supplier 1: Mouser; Supplier 2: Mouser; Supplier Part Number 1: 603-CC603KRX7R9BB104; Supplier Part Number 2: 710-885382206004; Package: 0603
C43 = C_1206: as C3 on sheet Power_Pos; Package: 1206; Value: 10µF; Supplier 1: Mouser; Supplier Part Number 1: 187-CL31A106MBHNNNE
C64 = C_1206: Capacitor 1206; MPN: 885342008009; Tolerance: 5%; MF: Würth Elektronik; Dielectric: C0G; Package: 1206; Value: 100pF; Created: 2018_06_25_AGeiger; Supplier 1: Mouser; Supplier Part Number 1: 710-885342008009
D2 = LED_Blue_0603: WL-SMCW SMD Mono-color Chip LED Waterclear, size 0603, Blue, 3.2 V, 140°; Forward Voltage: 3.2 V; Luminous Intensity: 145 mcd; Peak Wavelength: 465 nm; Dominant Wavelength: 470 nm; MF: Wuerth Elektronik; Published Date: Sep. 2017; ComponentLink1Description: Manufacturer; ComponentLink1URL: http://www.we-online.de; ComponentLink2Description: Datasheet; ComponentLink2URL: http://katalog.we-online.com/led/datasheet/150060BS75000.pdf; MPN: 150060BS75000; Size: 0603; Viewing Angle: 140°; Emitting Color: Blue; Value: 150060BS75000; Package: 0603; Created: 2018_09_06_AGeiger; Supplier 1: Farnell; Supplier Part Number 1: 2322069; Supplier 2: Mouser; Supplier Part Number 2: 710-150060BS75000; Supplier 3: Digi-Key; Supplier Part Number 3: 732-4966-1-ND
D3 D10 D14 = LED_Green_0603: WL-SMCW SMD Mono-color Chip LED Waterclear, size 0603, Green, 3.2 V, 140°; Forward Voltage: 3.2 V; Luminous Intensity: 430 mcd; Peak Wavelength: 515 nm; Dominant Wavelength: 520 nm; MF: Wuerth Elektronik; Published Date: Sep. 2017; ComponentLink1Description: Manufacturer; ComponentLink1URL: http://www.we-online.de; ComponentLink2Description: Datasheet; ComponentLink2URL: http://katalog.we-online.com/led/datasheet/150060GS75000.pdf; MPN: 150060GS75000; Size: 0603; Viewing Angle: 140°; Emitting Color: Green; Value: 150060GS75000; Package: 0603; Created: 2018_09_06_AGeiger; Supplier 1: Farnell; Supplier Part Number 1: 2322070; Supplier 2: Mouser; Supplier Part Number 2: 710-150060GS75000; Supplier 3: Digi-Key; Supplier Part Number 3: 732-4971-1-ND
D4 = LED_Red_0603: WL-SMCW SMD Mono-color Chip LED Waterclear, size 0603, Red, 2 V, 140°; Forward Voltage: 2 V; Luminous Intensity: 250 mcd; Peak Wavelength: 630 nm; Dominant Wavelength: 625 nm; MF: Wuerth Elektronik; Published Date: Sep. 2017; ComponentLink1Description: Manufacturer; ComponentLink1URL: http://www.we-online.de; ComponentLink2Description: Datasheet; ComponentLink2URL: http://katalog.we-online.com/led/datasheet/150060RS75000.pdf; MPN: 150060RS75000; Size: 0603; Viewing Angle: 140°; Emitting Color: Red; Value: 150060RS75000; Package: 0603; Created: 2018_09_06_AGeiger; Supplier 1: Farnell; Supplier Part Number 1: 2322071; Supplier 2: Mouser; Supplier Part Number 2: 710-150060RS75000; Supplier 3: Digi-Key; Supplier Part Number 3: 732-4978-1-ND
J1 = RJHSE-5380-02: Modular Connectors / Ethernet Connectors CAT 5 MODULAR JACK HIGH TEMP; MF: Amphenol; Pin Number: 8P8C; Port: 1x2; Entrance: Right Angle; Compliance: Lead free / RoHS; Rated Current: 1.5 A; Working Voltage: 125 VAC; Withstanding Voltage: 1000 VAC; Contact Resistance: 20 mOhm; ComponentLink1Description: Manufacturer; ComponentLink1URL: https://www.amphenol-icc.com/; ComponentLink2Description: Datasheet; ComponentLink2URL: https://cdn.amphenol-icc.com/media/wysiwyg/files/documentation/datasheet/inputoutput/io-modjack-rjhse.pdf; MPN: RJHSE-5380-02; Published Date: July 2018; Operating Temperature: -55 to 85 degC; Mounting Technology: THT; Packaging: Tray; Supplier 1: Mouser; Supplier Part Number 1: 523-RJHSE-5380-02; ComponentLink3Description: Product Drawing; ComponentLink3URL: https://cdn.amphenol-icc.com/media/wysiwyg/files/drawing/rjhsex38002.pdf
R28 = R_0603: MPN: CRCW0603499RFKEAC; MF: Vishay / Dale; Value: 499R; Supplier 1: Mouser; Supplier Part Number 1: 71-CRCW0603499RFKEAC; Package: 0603
R32 R56 R73 = R_0603: MPN: RCS06036K04FKEA; MF: Vishay / Dale; Value: 6.04k; Supplier 1: Mouser; Supplier Part Number 1: 71-RCS06036K04FKEA; Package: 0603
R35 = R_0603: MPN: CRCW06031M00FKEAC; MF: Vishay / Dale; Tolerance: 1%; Value: 1M; Supplier 1: mouser; Supplier Part Number 1: 71-CRCW06031M00FKEAC; Package: 0603
R55 = R_0603: MPN: CRCW060324K9FKEAC; MF: Vishay / Dale; Value: 24.9k; Supplier 1: Mouser; Supplier Part Number 1: 71-CRCW060324K9FKEAC; Package: 0603
X2 = IPL1-108-XX-X-D-X: 2.54mm Double Row Terminal Assembly; MF: SAMTEC; Value: IPL1-108-01-L-D-RA-K; Created: 2018_09_17_AGeiger; MPN: IPL1-108-01-L-D-RA-K; Supplier 1: Mouser; Supplier Part Number 1: 200-IPL110801LDRAK

## Sheet ADC.SchDoc
size A4; CompanyName: Technische Hochschule Nürnberg Georg Simon Ohm; Organization: UltraZohm; Address1: Kesslerplatz 12; Address2: 90489 Nürnberg; Address3: GERMANY; DocumentNumber: 6; SheetNumber: 6; SheetTotal: 6; Website: www.ultrazohm.com
Used 8 times, as channels ADC1, ADC2, ADC3, ADC4, ADC5, ADC6, ADC7, ADC8. Parts and nets are listed once, with the designators drawn on the sheet.
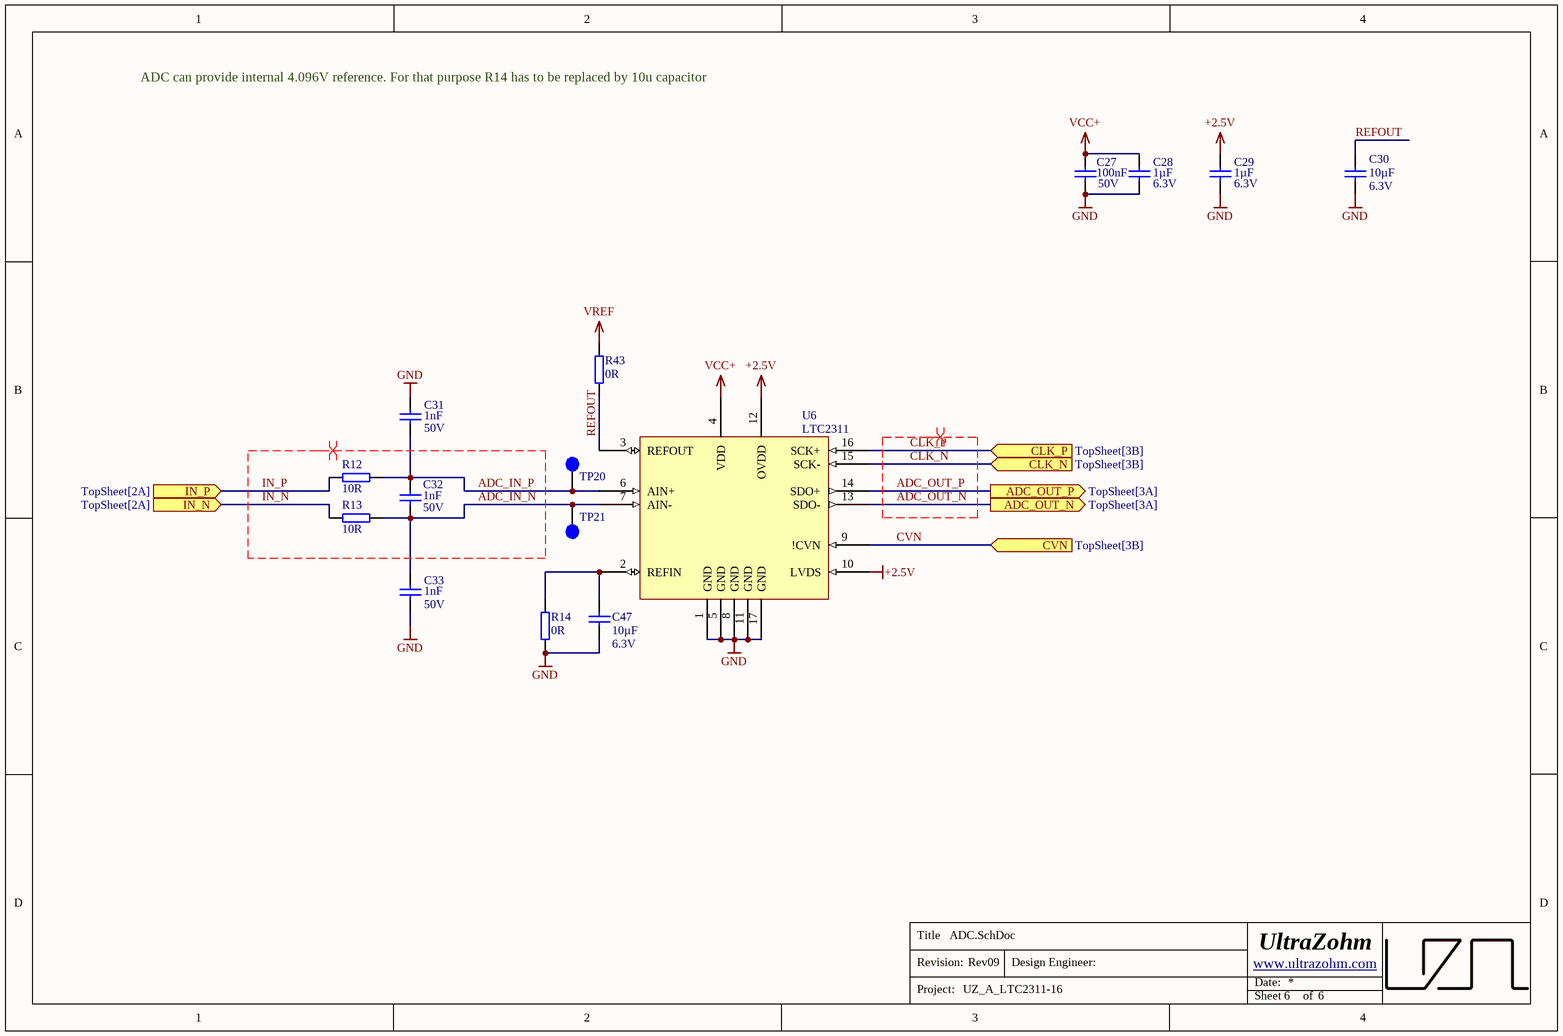
[diagram p4: ADC.SchDoc]

### Parts
C27  100nF  Voltage: 50V  [CAPC1608X07N]
C28  1µF  Voltage: 6.3V  [CAPC1608X07N]
C29  1µF  Voltage: 6.3V  [CAPC1608X07N]
C30  10µF  Voltage: 6.3V  [Cap0805]
C31  1nF  Voltage: 50V  [CAPC1608X07N]
C32  1nF  Voltage: 50V  [CAPC1608X07N]
C33  1nF  Voltage: 50V  [CAPC1608X07N]
C47  10µF  Voltage: 6.3V  [Cap0805]
R12  10R  [RESC1608X06N]
R13  10R  [RESC1608X06N]
R14  0R  [RESC1608X06N]
R43  0R  [RESC1608X06N]
TP20  +  [TP_1mm]  (value not drawn)  (no BOM)
TP21  -  [TP_1mm]  (value not drawn)  (no BOM)
U6  LTC2311  [TSSOP50P510X110_HS-17N]

### Ports
ADC_OUT_N (out, see TopSheet[3A]), ADC_OUT_P (out, see TopSheet[3A]), CLK_N (in, see TopSheet[3B]), CLK_P (in, see TopSheet[3B]), CVN (in, see TopSheet[3B]), IN_N (in, see TopSheet[2A]), IN_P (in, see TopSheet[2A])

### Nets
+2.5V: C29.1 U6.10(LVDS) U6.12(OVDD)
GND: C27.2 C28.2 C29.2 C30.2 C31.1 C33.2 C47.2 R14.1 U6.1(GND) U6.5(GND) U6.8(GND) U6.11(GND) U6.17(GND)
VCC+: C27.1 C28.1 U6.4(VDD)
VREF: R43.2
ADC_IN_N: C32.2 C33.1 R13.2 TP21.1 U6.7(AIN-)
ADC_IN_P: C31.2 C32.1 R12.2 TP20.1 U6.6(AIN+)
ADC_OUT_N: U6.13(SDO-) ; port ADC_OUT_N
ADC_OUT_P: U6.14(SDO+) ; port ADC_OUT_P
CLK_N: U6.15(SCK-) ; port CLK_N
CLK_P: U6.16(SCK+) ; port CLK_P
CVN: U6.9(!CVN) ; port CVN
IN_N: R13.1 ; port IN_N
IN_P: R12.1 ; port IN_P
REFOUT: C30.1 R43.1 U6.3(REFOUT)
NetC47_1: C47.1 R14.2 U6.2(REFIN)

### Channels
ADC1: designators end in A; ports ADC_OUT_N=ADC_OUT_N1 ADC_OUT_P=ADC_OUT_P1 CLK_N=CLK_N CLK_P=CLK_P CVN=CVN1 IN_N=OUT_N1 IN_P=OUT_P1
ADC2: designators end in B; ports ADC_OUT_N=ADC_OUT_N2 ADC_OUT_P=ADC_OUT_P2 CLK_N=CLK_N CLK_P=CLK_P CVN=CVN2 IN_N=OUT_N2 IN_P=OUT_P2
ADC3: designators end in C; ports ADC_OUT_N=ADC_OUT_N3 ADC_OUT_P=ADC_OUT_P3 CLK_N=CLK_N CLK_P=CLK_P CVN=CVN3 IN_N=OUT_N3 IN_P=OUT_P3
ADC4: designators end in D; ports ADC_OUT_N=ADC_OUT_N4 ADC_OUT_P=ADC_OUT_P4 CLK_N=CLK_N CLK_P=CLK_P CVN=CVN4 IN_N=OUT_N4 IN_P=OUT_P4
ADC5: designators end in E; ports ADC_OUT_N=ADC_OUT_N5 ADC_OUT_P=ADC_OUT_P5 CLK_N=CLK_N CLK_P=CLK_P CVN=CVN5 IN_N=OUT_N5 IN_P=OUT_P5
ADC6: designators end in F; ports ADC_OUT_N=ADC_OUT_N6 ADC_OUT_P=ADC_OUT_P6 CLK_N=CLK_N CLK_P=CLK_P CVN=CVN6 IN_N=OUT_N6 IN_P=OUT_P6
ADC7: designators end in G; ports ADC_OUT_N=ADC_OUT_N7 ADC_OUT_P=ADC_OUT_P7 CLK_N=CLK_N CLK_P=CLK_P CVN=CVN7 IN_N=OUT_N7 IN_P=OUT_P7
ADC8: designators end in H; ports ADC_OUT_N=ADC_OUT_N8 ADC_OUT_P=ADC_OUT_P8 CLK_N=CLK_N CLK_P=CLK_P CVN=CVN8 IN_N=OUT_N8 IN_P=OUT_P8

### Layout directives
differential pair: ADC_IN_N, ADC_IN_P, ADC_OUT_N, ADC_OUT_P, CLK_N, CLK_P, IN_N, IN_P

### Notes on the sheet
- ADC can provide internal 4.096V reference. For that purpose R14 has to be replaced by 10u capacitor
- Title
- Revision:
- Design Engineer:
- Date:
- Project:
- Sheet
- of

### Library data of the parts
C27 = Cap_0603: as C7 on sheet Power_Pos; Value: 100nF; Supplier 1: Mouser; Supplier 2: Mouser; Supplier Part Number 1: 603-CC603KRX7R9BB104; Supplier Part Number 2: 710-885382206004; Package: 0603
C28 C29 = Cap_0603: MPN: JMK107BJ105MA-T; MF: Taiyo Yuden; Dielectric: X5R; Value: 1µF; Supplier 1: Mouser; Supplier Part Number 1: 963-JMK107BJ105MA-T; Package: 0603
C30 C47 = Cap0805: CAP CER 0805; MPN: CL21A106KQFNNNE; MF: Samsung Electro-Mechanics; Dielectric: X5R; Supplier 1: Mouser; Supplier 2: *; Supplier Part Number 1: 187-CL21A106KQFNNNE; Supplier Part Number 2: *; Package: 0805; Value: 10µF
C31-C33 = Cap_0603: MPN: GRM1885C1H102GA1D; MF: Murata; Dielectric: NP0; Value: 1nF; Supplier 1: Mouser; Supplier 2: Mouser; Supplier Part Number 1: 81-GRM1885C1H102GA1D; Supplier Part Number 2: 81-GRM1885C1H102GA1J; Package: 0603
R12 R13 = R_0603: MPN: RC0603FR-0710RL; MF: Yageo; Value: 10R; Supplier 1: Mouser; Supplier Part Number 1: 603-RC0603FR-0710RL; Package: 0603
R14 R43 = R_0603: as R3 on sheet CarrierConnector; Value: 0R; Supplier 1: Mouser; Supplier Part Number 1: 71-CRCW06030000Z0EBC; Package: 0603
TP20 TP21 = TP_1mm: Testpoint 1mm; Created: 2018_06_25_AGeiger
  TP20: Value: +
  TP21: Value: -
U6 = LTC2311-16: 16 Bit SAR ADC, 5MSps; MPN: LTC2311CMSE-16#PBF; MF: Analog Devices; Package: MSOP-16; Supplier 1: Mouser; Supplier 2: Digi-Key; Supplier Part Number 1: 584-C2311CMSE-16PBF; Supplier Part Number 2: LTC2311CMSE-16#PBF-ND; ComponentLink1Description: Manufacturer; ComponentLink1URL: https://www.analog.com/en/index.html; ComponentLink2Description: Datasheet; ComponentLink2URL: https://www.analog.com/media/en/technical-documentation/data-sheets/231116fa.pdf

## Sheet OpAmp_CH1.SchDoc
size A4; CompanyName: Technische Hochschule Nürnberg Georg Simon Ohm; Organization: UltraZohm; Address1: Kesslerplatz 12; Address2: 90489 Nürnberg; Address3: GERMANY; DocumentNumber: 5; SheetNumber: 5; SheetTotal: 6; Website: www.ultrazohm.com
Used 8 times, as channels OpAmp1, OpAmp2, OpAmp3, OpAmp4, OpAmp5, OpAmp6, OpAmp7, OpAmp8. Parts and nets are listed once, with the designators drawn on the sheet.
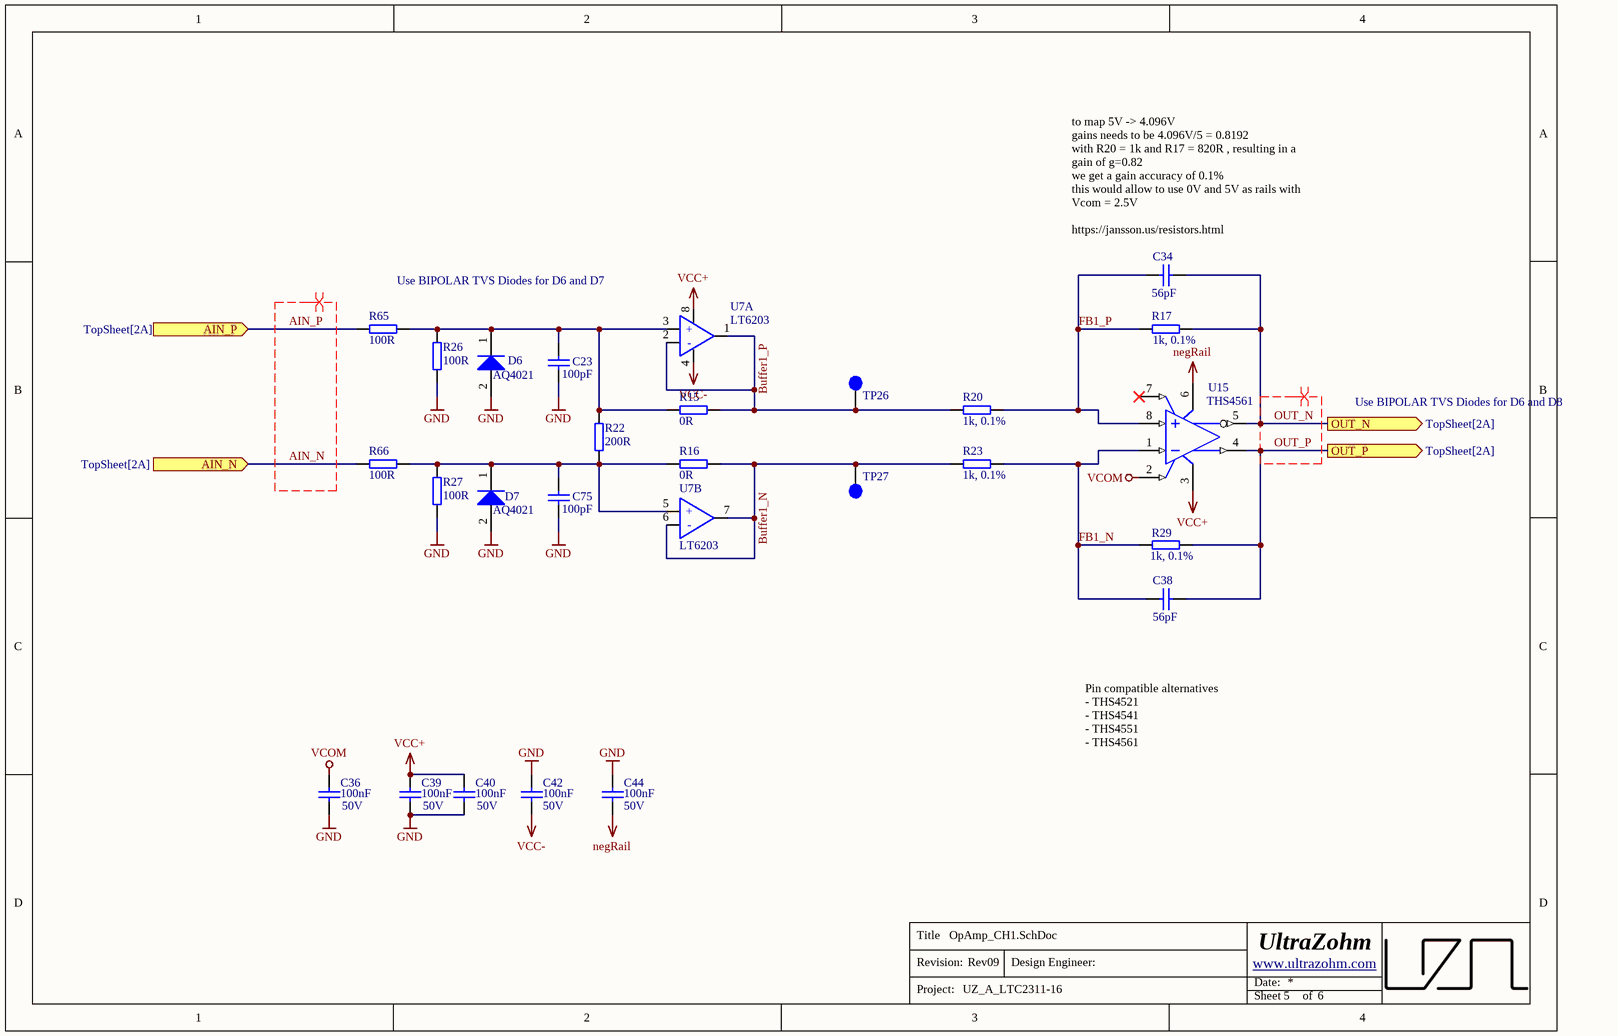
[diagram p5: OpAmp_CH1.SchDoc]

### Parts
C23  100pF  [CAPC1608X07N]
C34  56pF  [CAPC1608X07N]
C36  100nF  Voltage: 50V  [CAPC1608X07N]
C38  56pF  [CAPC1608X07N]
C39  100nF  Voltage: 50V  [CAPC1608X07N]
C40  100nF  Voltage: 50V  [CAPC1608X07N]
C42  100nF  Voltage: 50V  [CAPC1608X07N]
C44  100nF  Voltage: 50V  [CAPC1608X07N]
C75  100pF  [CAPC1608X07N]
D6  AQ4021  [SOD-323_SuppressorDiode]
D7  AQ4021  [SOD-323_SuppressorDiode]
R15  0R  [RESC1608X06N]
R16  0R  [RESC1608X06N]
R17  1k, 0.1%  [RESC1608X06N]
R20  1k, 0.1%  [RESC1608X06N]
R22  200R  [RESC3216X65N]
R23  1k, 0.1%  [RESC1608X06N]
R26  100R  [RESC1608X06N]
R27  100R  [RESC1608X06N]
R29  1k, 0.1%  [RESC1608X06N]
R65  100R  [RESC1608X06N]
R66  100R  [RESC1608X06N]
TP26  +  [TP_1mm]  (value not drawn)  (no BOM)
TP27  -  [TP_1mm]  (value not drawn)  (no BOM)
U7  LT6203  [MSOP8_3x3-8N]  (parts A,B of 2)
U15  THS4561  [DGK0008A_N]

### Ports
AIN_N (in, see TopSheet[2A]), AIN_P (in, see TopSheet[2A]), OUT_N (out, see TopSheet[2A]), OUT_P (out, see TopSheet[2A])

### Nets
GND: C23.2 C36.2 C39.2 C40.2 C42.1 C44.1 C75.2 D6.2(A) D7.2(A) R26.1 R27.1
negRail: C44.2 U15.6(VS-)
VCC+: C39.1 C40.1 U7.8 U15.3(VS+)
VCC-: C42.2 U7.4
VCOM: C36.1 U15.2(VOCM)
AIN_N: R66.1 ; port AIN_N
AIN_P: R65.1 ; port AIN_P
Buffer1_N: R16.2 R23.2 TP27.1 U7.6(-) U7.7
Buffer1_P: R15.2 R20.1 TP26.1 U7.1 U7.2(-)
FB1_N: C38.1 R23.1 R29.1 U15.1(VIN-)
FB1_P: C34.1 R17.1 R20.2 U15.8(VIN+)
OUT_N: C34.2 R17.2 U15.5(VOUT-) ; port OUT_N
OUT_P: C38.2 R29.2 U15.4(VOUT+) ; port OUT_P
NetC23_1: C23.1 D6.1(K) R15.1 R22.2 R26.2 R65.2 U7.3(+)
NetC75_1: C75.1 D7.1(K) R16.1 R22.1 R27.2 R66.2 U7.5(+)

Not connected (* = marked no-connect by the designer): U15 7(~{PD})*

### Channels
OpAmp1: designators end in A; ports AIN_N=AIN_N1 AIN_P=AIN_P1 OUT_N=OUT_N1 OUT_P=OUT_P1
OpAmp2: designators end in B; ports AIN_N=AIN_N2 AIN_P=AIN_P2 OUT_N=OUT_N2 OUT_P=OUT_P2
OpAmp3: designators end in C; ports AIN_N=AIN_N3 AIN_P=AIN_P3 OUT_N=OUT_N3 OUT_P=OUT_P3
OpAmp4: designators end in D; ports AIN_N=AIN_N4 AIN_P=AIN_P4 OUT_N=OUT_N4 OUT_P=OUT_P4
OpAmp5: designators end in E; ports AIN_N=AIN_N5 AIN_P=AIN_P5 OUT_N=OUT_N5 OUT_P=OUT_P5
OpAmp6: designators end in F; ports AIN_N=AIN_N6 AIN_P=AIN_P6 OUT_N=OUT_N6 OUT_P=OUT_P6
OpAmp7: designators end in G; ports AIN_N=AIN_N7 AIN_P=AIN_P7 OUT_N=OUT_N7 OUT_P=OUT_P7
OpAmp8: designators end in H; ports AIN_N=AIN_N8 AIN_P=AIN_P8 OUT_N=OUT_N8 OUT_P=OUT_P8

### Layout directives
differential pair: AIN_N, AIN_P, OUT_N, OUT_P

### Notes on the sheet
- (near C34) to map 5V -> 4.096V
  gains needs to be 4.096V/5 = 0.8192
  with R20 = 1k and R17 = 820R , resulting in a gain of g=0.82
  we get a gain accuracy of 0.1%
  this would allow to use 0V and 5V as rails with Vcom = 2.5V
  https://jansson.us/resistors.html
- Use BIPOLAR TVS Diodes for D6 and D7
- Use BIPOLAR TVS Diodes for D6 and D8
- Pin compatible alternatives
  - THS4521
  - THS4541
  - THS4551
  - THS4561
- Title
- Revision:
- Design Engineer:
- Date:
- Project:
- Sheet
- of

### Library data of the parts
C23 C75 = Cap_0603: MPN: 885012006057; MF: Würth Elektronik; Voltage: 50V; Dielectric: NP0; Value: 100pF; Supplier 1: Mouser; Supplier 2: *; Supplier Part Number 1: 710-885012006057; Supplier Part Number 2: *; Package: 0603
C34 C38 = Cap_0603: MPN: C0603C560J5GACTU; MF: Kemet; Voltage: 50V; Dielectric: C0G; Value: 56pF; Supplier 1: Mouser; Supplier 2: *; Supplier Part Number 1: 80-C0603C560J5G; Supplier Part Number 2: *; Package: 0603
C36 C39 C40 C42 C44 = Cap_0603: as C7 on sheet Power_Pos; Value: 100nF; Supplier 1: Mouser; Supplier 2: Mouser; Supplier Part Number 1: 603-CC603KRX7R9BB104; Supplier Part Number 2: 710-885382206004; Package: 0603
D6 D7 = GBLCxx: ESD Suppressor Diode TVS Bi-Dir 5V; MPN: AQ4021-01FTG-C; MF: Littelfuse; Reverse Standoff Voltage: 5.0V; Breakdown Voltage: 6.3V; Package: SOD-323; Supplier 1: Mouser; Supplier 2: Digi-Key; Supplier Part Number 1: 576-AQ4021-01FTG-C; Supplier Part Number 2: F10397CT-ND; ComponentLink1Description: Datasheet; Supplier 3: Farnell; Supplier Part Number 3: 2834965; Model: AQ4021
  D6: ComponentLink1URL: https://static6.arrow.com/aropdfconversion/cf1b73a38d87e210bfa153441e03466b149f09ba/gblci.pdf
  D7: ComponentLink1URL: https://www.littelfuse.com/~/media/electronics/datasheets/tvs_diode_arrays/littelfuse_tvs_diode_array_aq4021_datasheet.pdf.pdf?src-supplier=Digi-Key
R15 R16 = R_0603: as R3 on sheet CarrierConnector; Value: 0R; Supplier 1: Mouser; Supplier Part Number 1: 71-CRCW06030000Z0EBC; Package: 0603
R17 R20 R23 R29 = R_0603: Precision Resistor 1k 0.1% 0603; MPN: PCF-W0603LF-03-1001-B-P-LT; MF: IRC/TT Electronics; Precision: 0,1%; Value: 1k, 0.1%; Supplier 1: Mouser; Supplier Part Number 1: 66-PCFW0603LF031001B; Package: 0603; Supplier 2: RSComponents; Supplier Part Number 2: 178-6613; Supplier 3: RSComponents; Supplier Part Number 3: 520-3620
R22 = R_1206: WID SMD 1M 5% 0,25W; MPN: APC1206B200RN; AN: 22757; Mixed: SMT; Preferred: Yes; MF: AECOL/Ohmite; Case: 1206; Value: 200R; Technology: TK100; Created: 2018_07_20_AGeiger; Tolerance: 5%; Supplier 1: Mouser; Supplier Part Number 1: 284-APC1206B200RN
R26 R27 R65 R66 = R_0603: as R1 on sheet CarrierConnector; Value: 100R; Supplier 1: Mouser; Supplier Part Number 1: 603-AC0603FR-13100RL; Package: 0603
TP26 TP27 = TP_1mm: Testpoint 1mm; Created: 2018_06_25_AGeiger
  TP26: Value: +
  TP27: Value: -
U7 = LT6203_MSOP8: 2 Ch Low Noise, Low Power OpAmp; MPN: LT6203CMS8#PBF; MF: Linear Technology; Created: Kreppel_20190830; Package: MSOP-8; Supplier 1: Mouser; Supplier Part Number 1: 584-LT6203CMS8#PBF; ComponentLink1Description: Manufacturer; ComponentLink1URL: https://www.analog.com/en/index.html; ComponentLink2Description: Datasheet; ComponentLink2URL: https://www.analog.com/media/en/technical-documentation/data-sheets/620234fd.pdf
U15 = THS4521IDGKR: IC AMP RRO NEG OUT VLP 8VSSOP (Single Channel fully differential Amplifier); MPN: THS4561IDGKR; MF: Texas Instruments; Max Supply Voltage: 5.5V; Supplier 1: Mouser; Category: Amplifiers - Op Amps, Buffer, Instrumentation; Stock 1: 12114; Pricing 1: 1=2,55000, 10=2,29000, 25=2,16000, 100=1,78000, 250=1,59000, 500=1,54000, 1000=1,28000, 2500=1,25000, 1=2,83000, 10=2,54000, 25=2,40000, 100=1,98000, 250=1,77000, 500=1,71000 (EUR); ComponentLink1URL: https://datasheet.ciiva.com/14456/sbos458f-14456592.pdf?src-supplier=Avnet; ComponentLink1Description: old Datasheet; ComponentLink2URL: https://datasheet.ciiva.com/18622/ths4521-18622155.pdf?src-supplier=Digi-Key; ComponentLink2Description: Datasheet; ComponentLink3URL: https://www.ti.com/; ComponentLink3Description: Manufacturer; Supplier Part Number 1: 595-THS4561IDGKR; Supplier 2: Mouser; Supplier Part Number 2: 595-THS4521IDGKR